# Altium schematic sheet NB3000_Audio_DSP.SchDoc
size B; DocumentNumber: 1; SheetNumber: 1; SheetTotal: 3
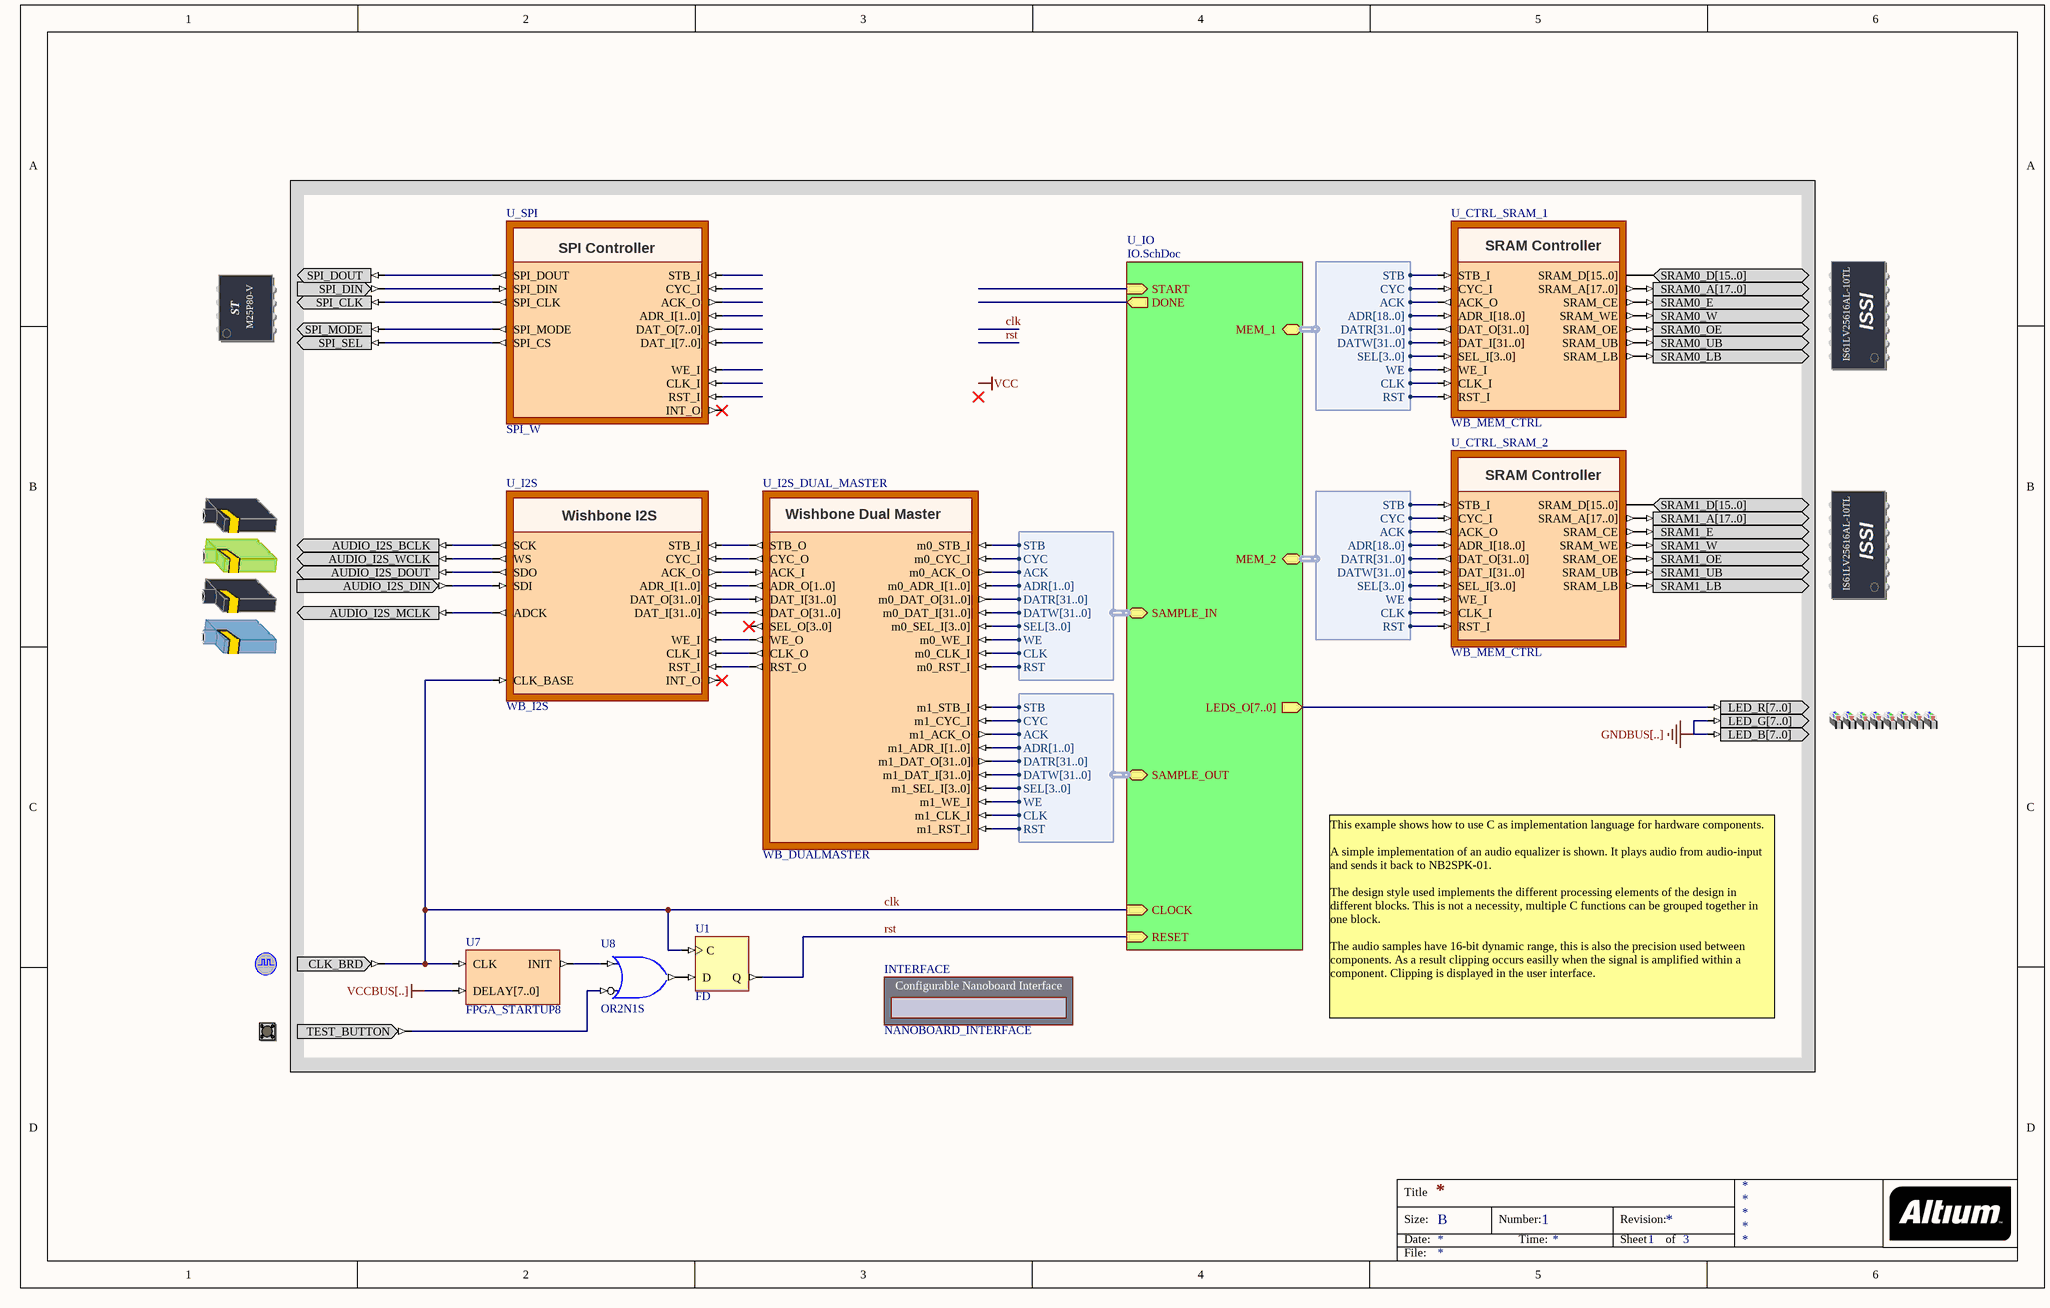
[diagram p0: NB3000_Audio_DSP.SchDoc]

## Parts
(Parts that share a designator on the sheet are numbered #1, #2 ... from top to bottom, then left to right.)
?#1  SERIALFMEMORY  (value not drawn)
?#2  SRAM0  (value not drawn)
?#3  SRAM1  (value not drawn)
?#4  AUDIO_CODEC  (value not drawn)
?#5  LEDS_RGB  (value not drawn)
?#6  CLOCK_BOARD  (value not drawn)
?#7  TEST_BUTTON  (value not drawn)
INTERFACE  NANOBOARD_INTERFACE
U1  FD
U7  FPGA_STARTUP8
U8  OR2N1S
U_CTRL_SRAM_1  WB_MEM_CTRL
U_CTRL_SRAM_2  WB_MEM_CTRL
U_I2S  WB_I2S
U_I2S_DUAL_MASTER  WB_DUALMASTER
U_SPI  SPI_W

## Sub-sheets
U_IO = IO.SchDoc: MEM_1 (harness WB_19_32_8), MEM_2 (harness WB_19_32_8), LEDS_O[7..0] (out), CLOCK (in), RESET (in), START (in), SAMPLE_IN (harness WB_2_32_8), SAMPLE_OUT (harness WB_2_32_8), DONE (out)

## Harnesses
WB_19_32_8: STB, CYC, ACK, ADR[18..0], DATR[31..0], DATW[31..0], SEL[3..0], WE, CLK, RST
WB_2_32_8: STB, CYC, ACK, ADR[1..0], DATR[31..0], DATW[31..0], SEL[3..0], WE, CLK, RST

## Nets
GNDBUS[..]: ?#5.LED_B[7..0] ?#5.LED_G[7..0]
VCCBUS[..]: U7.DELAY[7..0]
clk: ?#6.CLK_BRD U1.C U7.CLK U_I2S.CLK_BASE ; sheet U_IO/CLOCK
rst: U1.Q ; sheet U_IO/RESET
Net?#1_SPI_CLK: ?#1.SPI_CLK U_SPI.SPI_CLK
Net?#1_SPI_DIN: ?#1.SPI_DIN U_SPI.SPI_DIN
Net?#1_SPI_DOUT: ?#1.SPI_DOUT U_SPI.SPI_DOUT
Net?#1_SPI_MODE: ?#1.SPI_MODE U_SPI.SPI_MODE
Net?#1_SPI_SEL: ?#1.SPI_SEL U_SPI.SPI_CS
Net?#2_SRAM0_A[17..0]: ?#2.SRAM0_A[17..0] U_CTRL_SRAM_1.SRAM_A[17..0]
Net?#2_SRAM0_D[15..0]: ?#2.SRAM0_D[15..0] U_CTRL_SRAM_1.SRAM_D[15..0]
Net?#2_SRAM0_E: ?#2.SRAM0_E U_CTRL_SRAM_1.SRAM_CE
Net?#2_SRAM0_LB: ?#2.SRAM0_LB U_CTRL_SRAM_1.SRAM_LB
Net?#2_SRAM0_OE: ?#2.SRAM0_OE U_CTRL_SRAM_1.SRAM_OE
Net?#2_SRAM0_UB: ?#2.SRAM0_UB U_CTRL_SRAM_1.SRAM_UB
Net?#2_SRAM0_W: ?#2.SRAM0_W U_CTRL_SRAM_1.SRAM_WE
Net?#3_SRAM1_A[17..0]: ?#3.SRAM1_A[17..0] U_CTRL_SRAM_2.SRAM_A[17..0]
Net?#3_SRAM1_D[15..0]: ?#3.SRAM1_D[15..0] U_CTRL_SRAM_2.SRAM_D[15..0]
Net?#3_SRAM1_E: ?#3.SRAM1_E U_CTRL_SRAM_2.SRAM_CE
Net?#3_SRAM1_LB: ?#3.SRAM1_LB U_CTRL_SRAM_2.SRAM_LB
Net?#3_SRAM1_OE: ?#3.SRAM1_OE U_CTRL_SRAM_2.SRAM_OE
Net?#3_SRAM1_UB: ?#3.SRAM1_UB U_CTRL_SRAM_2.SRAM_UB
Net?#3_SRAM1_W: ?#3.SRAM1_W U_CTRL_SRAM_2.SRAM_WE
Net?#4_AUDIO_I2S_BCLK: ?#4.AUDIO_I2S_BCLK U_I2S.SCK
Net?#4_AUDIO_I2S_DIN: ?#4.AUDIO_I2S_DIN U_I2S.SDI
Net?#4_AUDIO_I2S_DOUT: ?#4.AUDIO_I2S_DOUT U_I2S.SDO
Net?#4_AUDIO_I2S_MCLK: ?#4.AUDIO_I2S_MCLK U_I2S.ADCK
Net?#4_AUDIO_I2S_WCLK: ?#4.AUDIO_I2S_WCLK U_I2S.WS
Net?#5_LED_R[7..0]: ?#5.LED_R[7..0] ; sheet U_IO/LEDS_O[7..0]
Net?#7_TEST_BUTTON: ?#7.TEST_BUTTON U8.I0
NetU1_D: U1.D U8.O
NetU7_INIT: U7.INIT U8.I1
NetU_CTRL_SRAM_1_ACK_O: U_CTRL_SRAM_1.ACK_O ; sheet U_IO/MEM_1.ACK
NetU_CTRL_SRAM_1_ADR_I[18..0]: U_CTRL_SRAM_1.ADR_I[18..0] ; sheet U_IO/MEM_1.ADR[18..0]
NetU_CTRL_SRAM_1_CLK_I: U_CTRL_SRAM_1.CLK_I ; sheet U_IO/MEM_1.CLK
NetU_CTRL_SRAM_1_CYC_I: U_CTRL_SRAM_1.CYC_I ; sheet U_IO/MEM_1.CYC
NetU_CTRL_SRAM_1_DAT_I[31..0]: U_CTRL_SRAM_1.DAT_I[31..0] ; sheet U_IO/MEM_1.DATW[31..0]
NetU_CTRL_SRAM_1_DAT_O[31..0]: U_CTRL_SRAM_1.DAT_O[31..0] ; sheet U_IO/MEM_1.DATR[31..0]
NetU_CTRL_SRAM_1_RST_I: U_CTRL_SRAM_1.RST_I ; sheet U_IO/MEM_1.RST
NetU_CTRL_SRAM_1_SEL_I[3..0]: U_CTRL_SRAM_1.SEL_I[3..0] ; sheet U_IO/MEM_1.SEL[3..0]
NetU_CTRL_SRAM_1_STB_I: U_CTRL_SRAM_1.STB_I ; sheet U_IO/MEM_1.STB
NetU_CTRL_SRAM_1_WE_I: U_CTRL_SRAM_1.WE_I ; sheet U_IO/MEM_1.WE
NetU_CTRL_SRAM_2_ACK_O: U_CTRL_SRAM_2.ACK_O ; sheet U_IO/MEM_2.ACK
NetU_CTRL_SRAM_2_ADR_I[18..0]: U_CTRL_SRAM_2.ADR_I[18..0] ; sheet U_IO/MEM_2.ADR[18..0]
NetU_CTRL_SRAM_2_CLK_I: U_CTRL_SRAM_2.CLK_I ; sheet U_IO/MEM_2.CLK
NetU_CTRL_SRAM_2_CYC_I: U_CTRL_SRAM_2.CYC_I ; sheet U_IO/MEM_2.CYC
NetU_CTRL_SRAM_2_DAT_I[31..0]: U_CTRL_SRAM_2.DAT_I[31..0] ; sheet U_IO/MEM_2.DATW[31..0]
NetU_CTRL_SRAM_2_DAT_O[31..0]: U_CTRL_SRAM_2.DAT_O[31..0] ; sheet U_IO/MEM_2.DATR[31..0]
NetU_CTRL_SRAM_2_RST_I: U_CTRL_SRAM_2.RST_I ; sheet U_IO/MEM_2.RST
NetU_CTRL_SRAM_2_SEL_I[3..0]: U_CTRL_SRAM_2.SEL_I[3..0] ; sheet U_IO/MEM_2.SEL[3..0]
NetU_CTRL_SRAM_2_STB_I: U_CTRL_SRAM_2.STB_I ; sheet U_IO/MEM_2.STB
NetU_CTRL_SRAM_2_WE_I: U_CTRL_SRAM_2.WE_I ; sheet U_IO/MEM_2.WE
NetU_I2S_ACK_O: U_I2S.ACK_O U_I2S_DUAL_MASTER.ACK_I
NetU_I2S_ADR_I[1..0]: U_I2S.ADR_I[1..0] U_I2S_DUAL_MASTER.ADR_O[1..0]
NetU_I2S_CLK_I: U_I2S.CLK_I U_I2S_DUAL_MASTER.CLK_O
NetU_I2S_CYC_I: U_I2S.CYC_I U_I2S_DUAL_MASTER.CYC_O
NetU_I2S_DAT_I[31..0]: U_I2S.DAT_I[31..0] U_I2S_DUAL_MASTER.DAT_O[31..0]
NetU_I2S_DAT_O[31..0]: U_I2S.DAT_O[31..0] U_I2S_DUAL_MASTER.DAT_I[31..0]
NetU_I2S_DUAL_MASTER_m0_ACK_O: U_I2S_DUAL_MASTER.m0_ACK_O ; sheet U_IO/SAMPLE_IN.ACK
NetU_I2S_DUAL_MASTER_m0_ADR_I[1..0]: U_I2S_DUAL_MASTER.m0_ADR_I[1..0] ; sheet U_IO/SAMPLE_IN.ADR[1..0]
NetU_I2S_DUAL_MASTER_m0_CLK_I: U_I2S_DUAL_MASTER.m0_CLK_I ; sheet U_IO/SAMPLE_IN.CLK
NetU_I2S_DUAL_MASTER_m0_CYC_I: U_I2S_DUAL_MASTER.m0_CYC_I ; sheet U_IO/SAMPLE_IN.CYC
NetU_I2S_DUAL_MASTER_m0_DAT_I[31..0]: U_I2S_DUAL_MASTER.m0_DAT_I[31..0] ; sheet U_IO/SAMPLE_IN.DATW[31..0]
NetU_I2S_DUAL_MASTER_m0_DAT_O[31..0]: U_I2S_DUAL_MASTER.m0_DAT_O[31..0] ; sheet U_IO/SAMPLE_IN.DATR[31..0]
NetU_I2S_DUAL_MASTER_m0_RST_I: U_I2S_DUAL_MASTER.m0_RST_I ; sheet U_IO/SAMPLE_IN.RST
NetU_I2S_DUAL_MASTER_m0_SEL_I[3..0]: U_I2S_DUAL_MASTER.m0_SEL_I[3..0] ; sheet U_IO/SAMPLE_IN.SEL[3..0]
NetU_I2S_DUAL_MASTER_m0_STB_I: U_I2S_DUAL_MASTER.m0_STB_I ; sheet U_IO/SAMPLE_IN.STB
NetU_I2S_DUAL_MASTER_m0_WE_I: U_I2S_DUAL_MASTER.m0_WE_I ; sheet U_IO/SAMPLE_IN.WE
NetU_I2S_DUAL_MASTER_m1_ACK_O: U_I2S_DUAL_MASTER.m1_ACK_O ; sheet U_IO/SAMPLE_OUT.ACK
NetU_I2S_DUAL_MASTER_m1_ADR_I[1..0]: U_I2S_DUAL_MASTER.m1_ADR_I[1..0] ; sheet U_IO/SAMPLE_OUT.ADR[1..0]
NetU_I2S_DUAL_MASTER_m1_CLK_I: U_I2S_DUAL_MASTER.m1_CLK_I ; sheet U_IO/SAMPLE_OUT.CLK
NetU_I2S_DUAL_MASTER_m1_CYC_I: U_I2S_DUAL_MASTER.m1_CYC_I ; sheet U_IO/SAMPLE_OUT.CYC
NetU_I2S_DUAL_MASTER_m1_DAT_I[31..0]: U_I2S_DUAL_MASTER.m1_DAT_I[31..0] ; sheet U_IO/SAMPLE_OUT.DATW[31..0]
NetU_I2S_DUAL_MASTER_m1_DAT_O[31..0]: U_I2S_DUAL_MASTER.m1_DAT_O[31..0] ; sheet U_IO/SAMPLE_OUT.DATR[31..0]
NetU_I2S_DUAL_MASTER_m1_RST_I: U_I2S_DUAL_MASTER.m1_RST_I ; sheet U_IO/SAMPLE_OUT.RST
NetU_I2S_DUAL_MASTER_m1_SEL_I[3..0]: U_I2S_DUAL_MASTER.m1_SEL_I[3..0] ; sheet U_IO/SAMPLE_OUT.SEL[3..0]
NetU_I2S_DUAL_MASTER_m1_STB_I: U_I2S_DUAL_MASTER.m1_STB_I ; sheet U_IO/SAMPLE_OUT.STB
NetU_I2S_DUAL_MASTER_m1_WE_I: U_I2S_DUAL_MASTER.m1_WE_I ; sheet U_IO/SAMPLE_OUT.WE
NetU_I2S_RST_I: U_I2S.RST_I U_I2S_DUAL_MASTER.RST_O
NetU_I2S_STB_I: U_I2S.STB_I U_I2S_DUAL_MASTER.STB_O
NetU_I2S_WE_I: U_I2S.WE_I U_I2S_DUAL_MASTER.WE_O

Not connected (* = marked no-connect by the designer): U_I2S INT_O*; U_I2S_DUAL_MASTER SEL_O[3..0]*; U_SPI ACK_O ADR_I[1..0] CLK_I CYC_I DAT_I[7..0] DAT_O[7..0] INT_O* RST_I STB_I WE_I

## Notes on the sheet
- This example shows how to use C as implementation language for hardware components.
  A simple implementation of an audio equalizer is shown. It plays audio from audio-input and sends it back to NB2SPK-01.
  The design style used implements the different processing elements of the design in different blocks. This is not a necessity, multiple C functions can be grouped together in one block.
  The audio samples have 16-bit dynamic range, this is also the precision used between components. As a result clipping occurs easilly when the signal is amplified within a component. Clipping is displayed in the user interface.
- Labels drawn without touching a wire or pin: VCC
- Title
- Size:
- Date:
- B
- Number:
- Time:
- Revision:
- Sheet
- of
- File:
- (in symbol SERIALFMEMORY) ST; M25P80-V
- (in symbol SPI_W) SPI Controller
- (in symbol SRAM0) ISSI; IS61LV25616AL-10TL
- (in symbol SRAM1) ISSI; IS61LV25616AL-10TL
- (in symbol WB_DUALMASTER) Wishbone Dual Master
- (in symbol WB_I2S) Wishbone I2S
- (in symbol WB_MEM_CTRL) SRAM Controller

## Library data of the parts
?#1 = SERIALFMEMORY: Serial SPI Flash RAM; PortComponent: True; Published: 19-Nov-2003; Publisher: Altium Limited; HelpURL: https://wiki.altium.com/display/ADOH/NanoBoard+3000+-+Serial+SPI+Flash+Memory; UseInDSF: True
?#2 = SRAM0: Free Static RAM - Daughterboard; PortComponent: True; Published: 14-May-2007; Publisher: Altium Limited; HelpURL: https://wiki.altium.com/display/ADOH/NanoBoard+3000+-+Independent+SRAM
?#3 = SRAM1: Free Static RAM - Daughterboard; PortComponent: True; Published: 14-May-2007; Publisher: Altium Limited; HelpURL: https://wiki.altium.com/display/ADOH/NanoBoard+3000+-+Independent+SRAM
?#4 = AUDIO_CODEC: Audio Codec; PortComponent: True; IncludeInDSF: AUDIO_CS4270; Published: 22-Jan-2007; Publisher: Altium Limited; HelpURL: https://wiki.altium.com/display/ADOH/NanoBoard+3000+-+Audio+CODEC
?#5 = LEDS_RGB: LEDS RGB; PortComponent: True; Published: 11-Mar-2009; Publisher: Altium Limited; HelpURL: https://wiki.altium.com/display/ADOH/NanoBoard+3000+-+RGB+User+LEDs
?#6 = CLOCK_BOARD: Global System Clock Supply; PortComponent: True; Published: 19-Nov-2003; Publisher: Altium Limited; HelpURL: https://wiki.altium.com/display/ADOH/NanoBoard+3000+-+System+Clocks; UseInDSF: True
?#7 = TEST_BUTTON: Test / Reset Button; PortComponent: True; Published: 19-Nov-2003; Publisher: Altium Limited; HelpURL: https://wiki.altium.com/display/ADOH/NanoBoard+3000+-+Test-Reset+Button
INTERFACE = NANOBOARD_INTERFACE: Configurable Nanoboard Interface; NEXUS_CORE: Instrument; NEXUS_JTAG_DEVICE: True; NEXUS_JTAG_ORDER: 0; ConfiguratorName: DIGITAL_IO_APPLICATION; ConfigurationParameters: {}Version[1.0]{}StorageType[0]{}SubProjectPath[InstrumentScript.PrjScr]{}ID[{B1C64D67-B2EF-4457-A3CA-97753D242B29}]{}DisabledInDashboard[False]{}AutoRun[False]{}Instrument0Designator[EQ_SETTINGS]{}Instrument0ViewerStyle[None]{}Instrument1Designator[SETTINGS]{}Instrument1ViewerStyle[None]{}Instrument2Designator[STATUS]{}Instrument2ViewerStyle[None]{}Instrument3Designator[U_EQ_STATUS]{}Instrument3ViewerStyle[None]{}; ComponentLink1Description: Core &Resource Usage; ComponentLink1URL: CR0134 FPGA Instrument Resource Usage.pdf; Core Revision: 1.00.00; LastRevisionNo: 1.00.00; Published: 06-May-2009; Publisher: Altium Limited
U1 = FD: D-Type Flip-Flop; ClockTrigger: Rising; ArchiveName: GENERIC; VHDLIB_SIM: GENERIC_LIB; Published: 29-Jan-2004; Publisher: Altium Limited; XilinxEquivalent: FD; LastRevisionNo: 1.00.00; HelpURL: CR0118 FPGA Generic Library Guide.pdf#page=170; ComponentLink1URL: CR0133 FPGA Flip Flop Resource Usage.pdf#page=4; ComponentLink1Description: Core &Resource Usage; FunctionalClass: Flip-Flop; SubClass: FD
U7 = FPGA_STARTUP8: FPGA Startup With 8 Bit Delay; Published: 9-Dec-2004; Publisher: Altium Limited; HelpURL: CR0119 FPGA_STARTUPx Powerup Delay Unit.pdf; LastRevisionNo: 1.00.00; ComponentLink1Description: Core &Resource Usage; ComponentLink1URL: CR0139 FPGA Peripheral Resource Usage.pdf#page=11
U8 = OR2N1S: 2-Input OR Gate with Active Low A Input, Single Pin Version; XilinxEquivalent: OR2B1; FunctionalClass: Logic Primitive; PortSize: 2; ArchiveName: GENERIC; VHDLIB_SIM: GENERIC_LIB; Published: 29-Jan-2004; Publisher: Altium Limited; LastRevisionNo: 1.00.00; HelpURL: CR0118 FPGA Generic Library Guide.pdf#page=410; ComponentLink1URL: CR0136 FPGA Logic Primitive Resource Usage.pdf#page=187; ComponentLink1Description: Core &Resource Usage; SubClass: OR; PortStyle: Single Pin Version
U_CTRL_SRAM_1 U_CTRL_SRAM_2 = WB_MEM_CTRL: Configurable Memory Controller; ConfigurationParameters: {}Version[1.0]{}Option_MemoryType[Asynchronous SRAM]{}Option_MemorySize[512 KB (128K x 32-bit)]{}Option_Layout[1 x 16-bit Wide Device]{}Option_Read[2]{}Option_WriteSetup[1]{}Option_WritePulse[1]{}Option_WriteHold[1]{}Option_FlashRead[4]{}Option_FlashWriteSetup[1]{}Option_FlashWritePulse[5]{}Option_FlashWriteHold[1]{}Option_SdramKeepRowOpen[0]{}Option_SdramClock[100]{}Option_SdramWriteRecovery[4]{}Option_SdramAutoRefresh[16]{}Option_SdramActiveToReadWrite[8]{}Option_SdramPrecharge[16]{}Option_SdramCasLatency[2]{}Option_SdramClockScheme[0]{}; UseInDSF: True; ComponentLink1Description: Core &Resource Usage; ComponentLink1URL: CR0139 FPGA Peripheral Resource Usage.pdf#page=85; HelpURL: CR0152 WB_MEM_CTRL Configurable Wishbone Memory Controller.pdf; LastRevisionNo: 1.00.00; Published: 9-Dec-2004; Publisher: Altium Limited; ConfiguratorName: WB_MEM_CTRL
U_I2S = WB_I2S: Wishbone I2S Controller; UseInDSF: True; ConfigurationParameters: {}Version[1.0]{}Option_Channels[2]{}Option_BufferSize[3]{}Option_BufferEnabled[False]{}; ConfiguratorName: WB_I2S; LastRevisionNo: 1.00.00; Published: 11-Dec-2007; Publisher: Altium Limited
U_I2S_DUAL_MASTER = WB_DUALMASTER: Configurable Wishbone Dual Master; ConfigurationParameters: {}Version[1.0]{}DataWidth[0]{}AddressWidth[2]{}SpaceAfter[3]{}DualType[0]{}PriorityDevice[0]; ComponentLink1Description: Core &Resource Usage; ComponentLink1URL: CR0139 FPGA Peripheral Resource Usage.pdf#page=70; HelpURL: https://wiki.altium.com/display/ADOH/WB_DUALMASTER+-+Configurable+Wishbone+Dual+Master; LastRevisionNo: 1.00.00; Published: 9-Dec-2004; Publisher: Altium Limited; ConfiguratorName: WB_DUALMASTER
U_SPI = SPI_W: SPI Controller Wishbone; UseInDSF: True; Published: 9-Dec-2004; Publisher: Altium Limited; ComponentLink1Description: Core &Resource Usage; ComponentLink1URL: CR0139 FPGA Peripheral Resource Usage.pdf#page=61; HelpURL: CR0153 SPI_W Serial Peripheral Interface Controller.pdf; LastRevisionNo: 1.05.01; LatestRevisionNote: Correction for the busy signal generation; LatestRevisionDate: 6-Sep-2005